# EAGLE schematic dash-hat (EAGLE 7.7.0)
Assembly variants: REVC
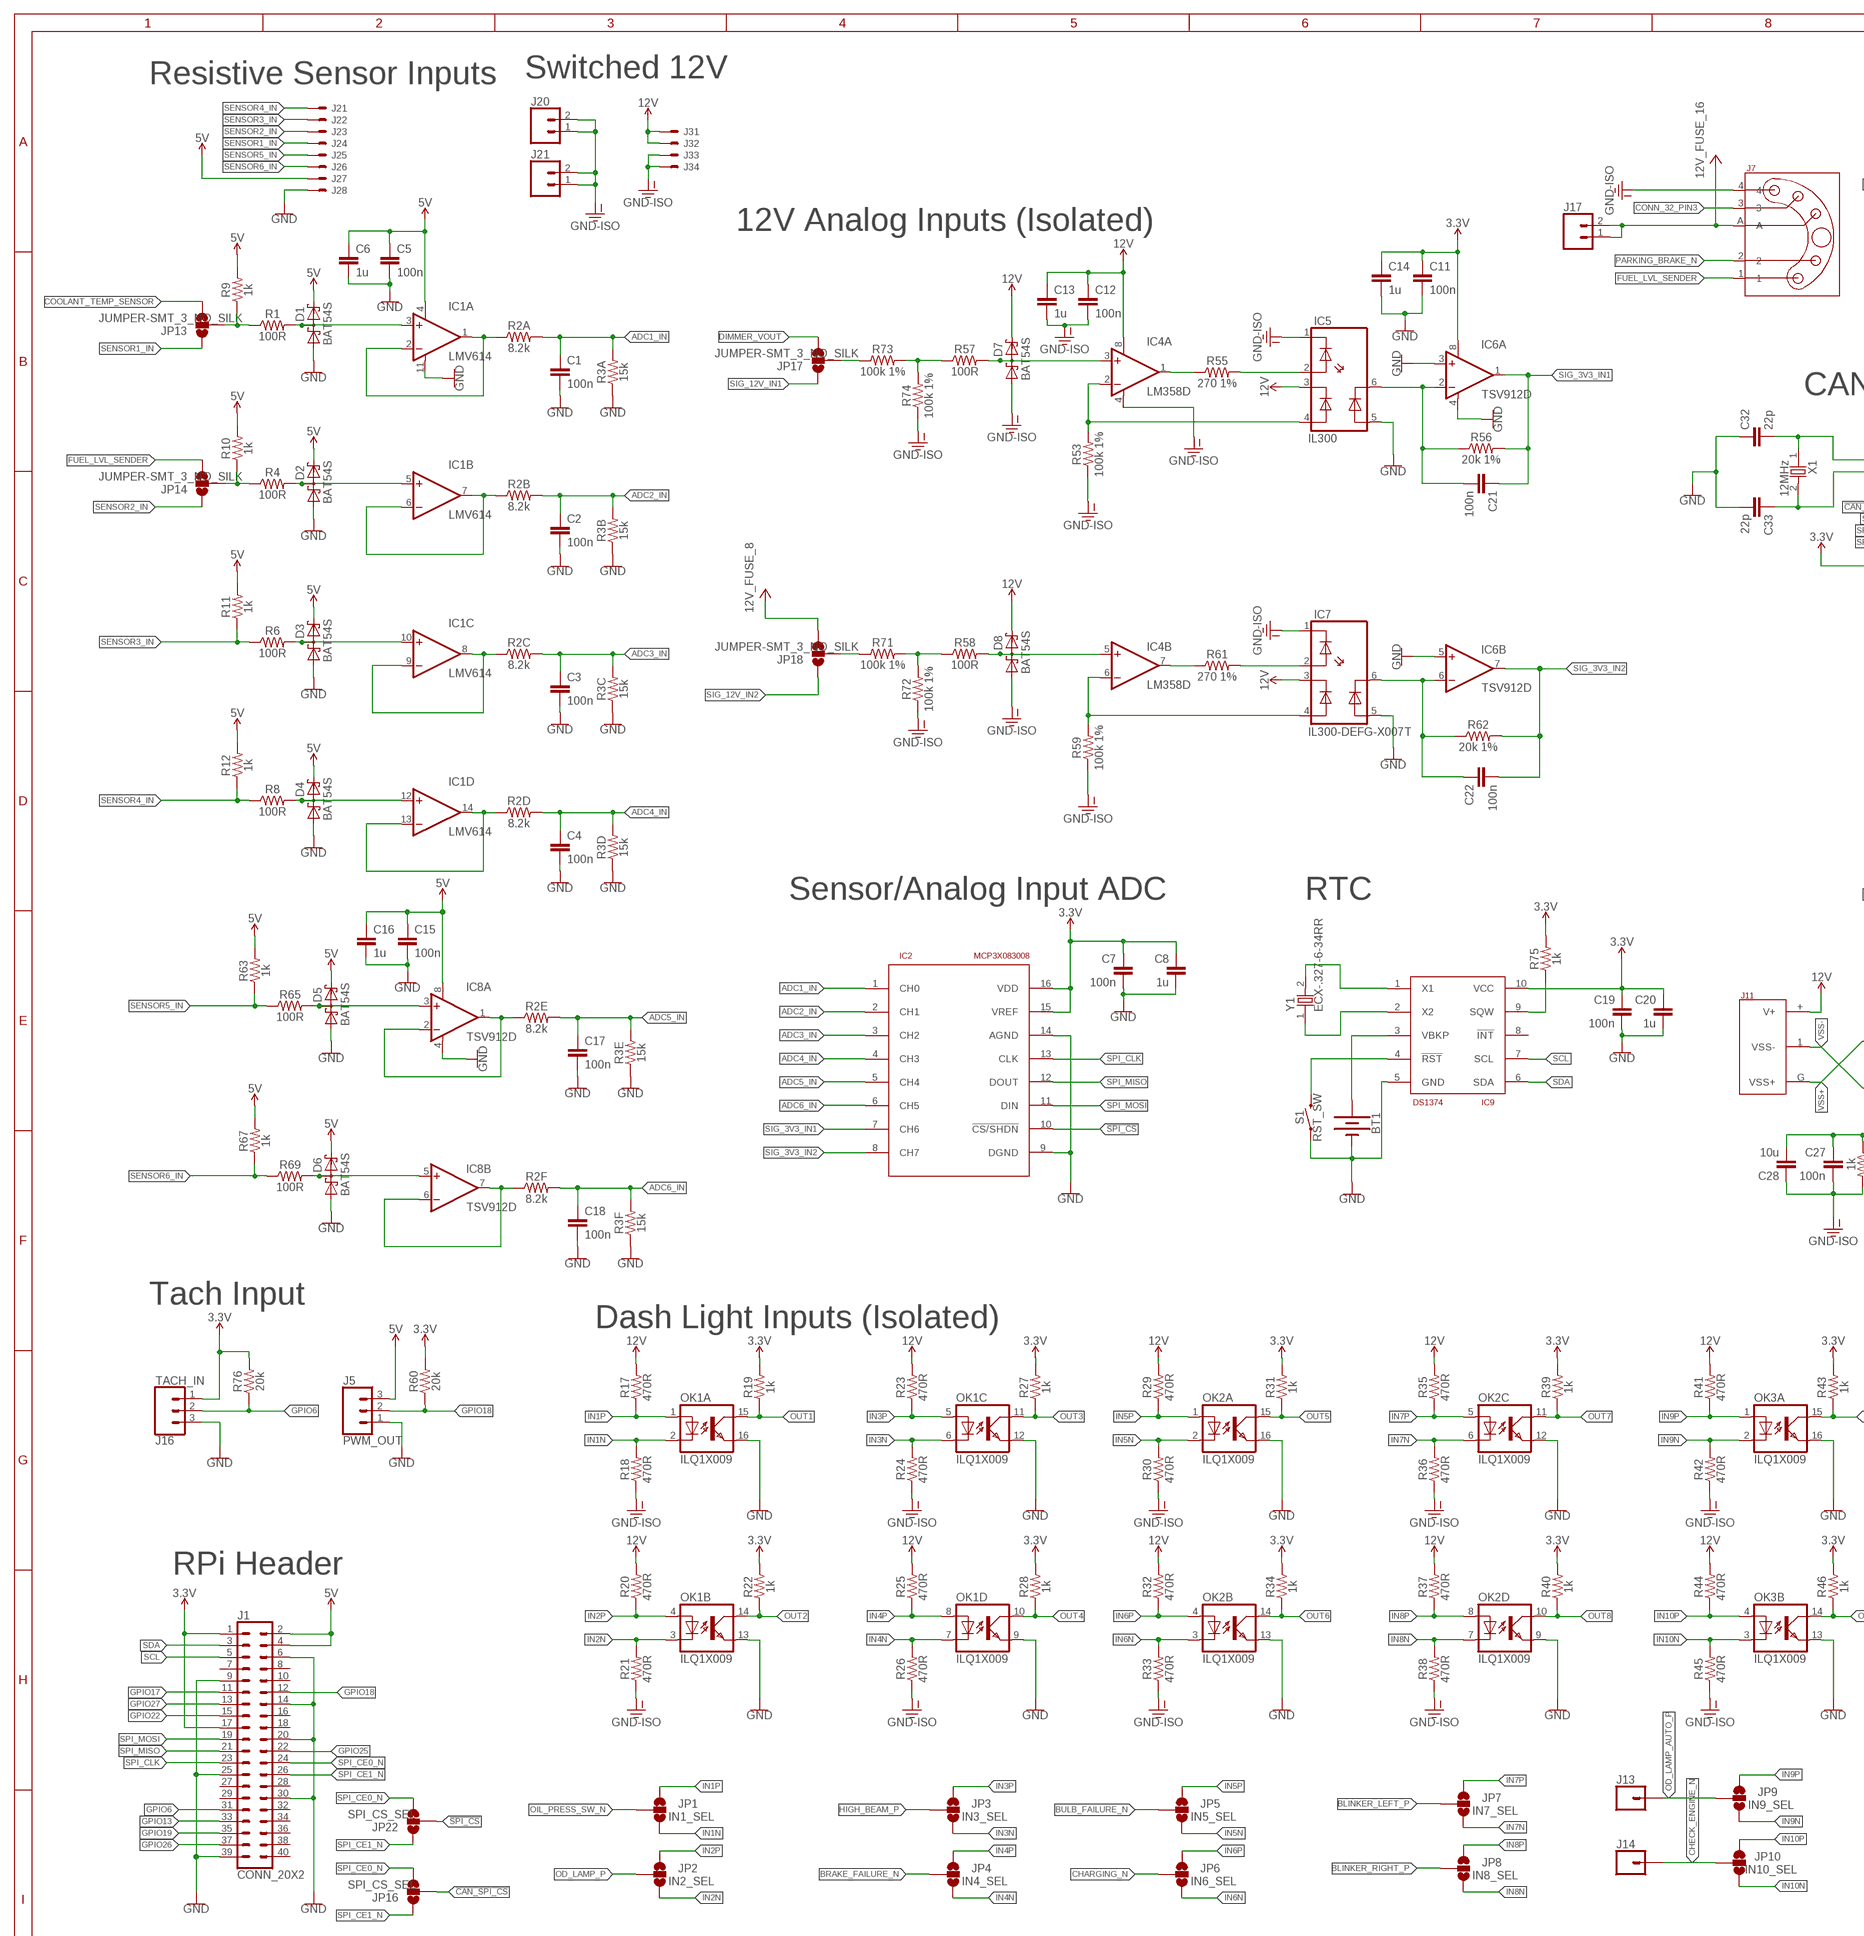
[diagram p0: schematic, sheet 1, part 1 of 2]
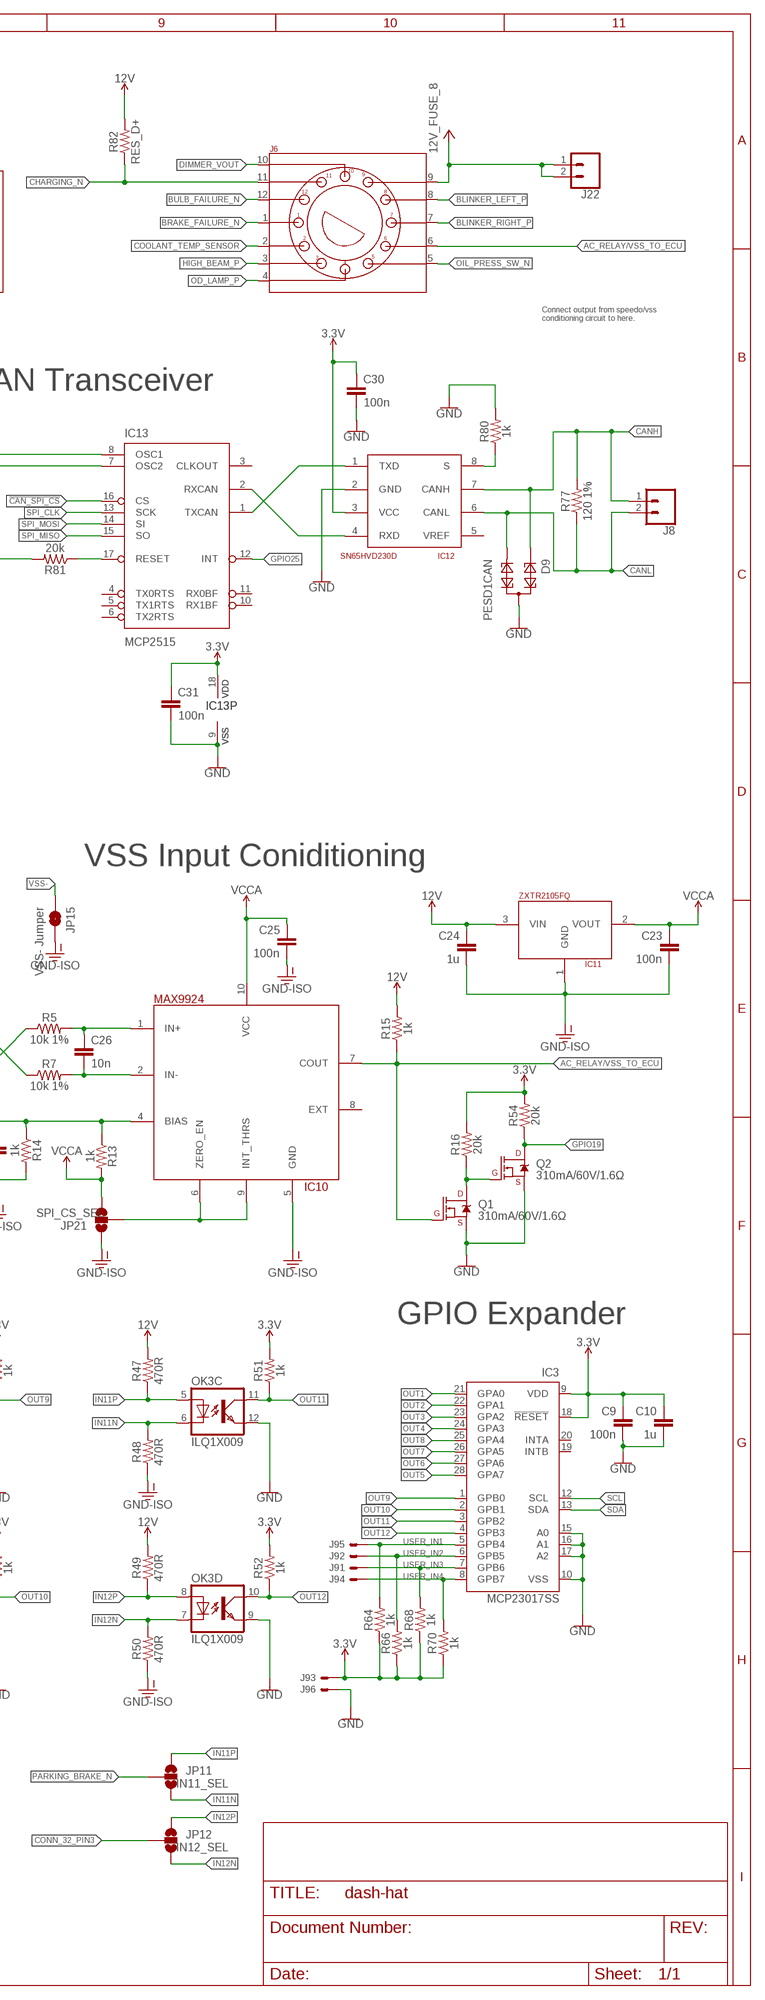
[diagram p1: schematic, sheet 1, part 2 of 2]

## Parts
BT1  BATTERY-12MM_SMD  [BATTCON_12MM]
C1  100n  CL10B104MB8NNNC  [0603]
C2  100n  CL10B104MB8NNNC  [0603]
C3  100n  CL10B104MB8NNNC  [0603]
C4  100n  CL10B104MB8NNNC  [0603]
C5  100n  CL10B104MB8NNNC  [0603]
C6  1u  CL10A105KA8NNNC  [0603]
C7  100n  CL10B104MB8NNNC  [0603]
C8  1u  CL10A105KA8NNNC  [0603]
C9  100n  CL10B104MB8NNNC  [0603]
C10  1u  CL10A105KA8NNNC  [0603]
C11  100n  CL10B104MB8NNNC  [0603]
C12  100n  CL10B104MB8NNNC  [0603]
C13  1u  CL10A105KA8NNNC  [0603]
C14  1u  CL10A105KA8NNNC  [0603]
C15  100n  CL10B104MB8NNNC  [0603]
C16  1u  CL10A105KA8NNNC  [0603]
C17  100n  CL10B104MB8NNNC  [0603]
C18  100n  CL10B104MB8NNNC  [0603]
C19  100n  CL10B104MB8NNNC  [0603]
C20  1u  CL10A105KA8NNNC  [0603]
C21  100n  CL10B104MB8NNNC  [0603]
C22  100n  CL10B104MB8NNNC  [0603]
C23  100n  CL10B104MB8NNNC  [0603]
C24  1u  CL10A105KA8NNNC  [0603]
C25  100n  CL10B104MB8NNNC  [0603]
C26  10n  CL10B103KB8NNNC  [0603]
C27  100n  CL10B104MB8NNNC  [0603]
C28  10u  CL10B106MQ8NRNC  [0603]
C30  100n  CL10B104MB8NNNC  [0603]
C31  100n  CL10B104MB8NNNC  [0603]
C32  22p  CL10C220JB81PNC  [0603]
C33  22p  CL10C220JB81PNC  [0603]
D1  BAT54S  [SOT23]
D2  BAT54S  [SOT23]
D3  BAT54S  [SOT23]
D4  BAT54S  [SOT23]
D5  BAT54S  [SOT23]
D6  BAT54S  [SOT23]
D7  BAT54S  [SOT23]
D8  BAT54S  [SOT23]
D9  PESD1CAN  [SOT23]
IC1  LMV614  [TSSOP14]
IC2  MCP3X083008  [SO16]
IC3  MCP23017SS  [SSOP28]
IC4  LM358D  [SO08]
IC5  IL300  [DIL8-SMD]
IC6  TSV912D  [SO08]
IC7  IL300-DEFG-X007T  [DIL8-SMD]
IC8  TSV912D  [SO08]
IC9  DS1374  [UMAX10]
IC10  MAX9924  [UMAX10]
IC11  ZXTR2105FQ  [SOT23]
IC12  SN65HVD230D  [SO08]
IC13  MCP2515  MCP2515(MCP2510)SO  [SO18W]
J1  CONN_20X2  [2X20]
J2  CONN_04X2  [MOLEX-1053102108]
J3  CONN_04RIGHT-ANGLE  [MOLEX-1053141204]
J5  PWM_OUT  CONN_03JST-XHP  [1X03_JST-XHP]
J6  VOLVO_CONN_31  [VOLVO_CON_31]
J7  VOLVO_CONN_32  [VOLVO_CON_32]
J8  CONN_02JST-XHP  [1X02_JST-XHP]
J9  CONN_03X2  [MOLEX-1053101106]
J11  VOLVO_CONN_VSS  [VOLVO_CONN_VSS]
J13  CONN_01PTH_2MM  [1X01_2MM]
J14  CONN_01PTH_2MM  [1X01_2MM]
J16  TACH_IN  CONN_03JST-XHP  [1X03_JST-XHP]
J17  CONN_02PTH4  [1X02_XTRA_BIG]
J20  CONN_02PTH4  [1X02_XTRA_BIG]
J21  CONN_02PTH4  [1X02_XTRA_BIG]
J22  CONN_02PTH4  [1X02_XTRA_BIG]
JP1  IN1_SEL  JUMPER-SMT_3_NO_SILK  [SMT-JUMPER_3_NO_SILK]
JP2  IN2_SEL  JUMPER-SMT_3_NO_SILK  [SMT-JUMPER_3_NO_SILK]
JP3  IN3_SEL  JUMPER-SMT_3_NO_SILK  [SMT-JUMPER_3_NO_SILK]
JP4  IN4_SEL  JUMPER-SMT_3_NO_SILK  [SMT-JUMPER_3_NO_SILK]
JP5  IN5_SEL  JUMPER-SMT_3_NO_SILK  [SMT-JUMPER_3_NO_SILK]
JP6  IN6_SEL  JUMPER-SMT_3_NO_SILK  [SMT-JUMPER_3_NO_SILK]
JP7  IN7_SEL  JUMPER-SMT_3_NO_SILK  [SMT-JUMPER_3_NO_SILK]
JP8  IN8_SEL  JUMPER-SMT_3_NO_SILK  [SMT-JUMPER_3_NO_SILK]
JP9  IN9_SEL  JUMPER-SMT_3_NO_SILK  [SMT-JUMPER_3_NO_SILK]
JP10  IN10_SEL  JUMPER-SMT_3_NO_SILK  [SMT-JUMPER_3_NO_SILK]
JP11  IN11_SEL  JUMPER-SMT_3_NO_SILK  [SMT-JUMPER_3_NO_SILK]
JP12  IN12_SEL  JUMPER-SMT_3_NO_SILK  [SMT-JUMPER_3_NO_SILK]
JP13  JUMPER-SMT_3_NO_SILK  [SMT-JUMPER_3_NO_SILK]
JP14  JUMPER-SMT_3_NO_SILK  [SMT-JUMPER_3_NO_SILK]
JP15  VSS- Jumper  JUMPER-SMT_2_NO_SILK  [SMT-JUMPER_2_NO_SILK]
JP16  SPI_CS_SEL  JUMPER-SMT_3_NO_SILK  [SMT-JUMPER_3_NO_SILK]
JP17  JUMPER-SMT_3_NO_SILK  [SMT-JUMPER_3_NO_SILK]
JP18  JUMPER-SMT_3_NO_SILK  [SMT-JUMPER_3_NO_SILK]
JP21  SPI_CS_SEL  JUMPER-SMT_3_NO_SILK  [SMT-JUMPER_3_NO_SILK]
JP22  SPI_CS_SEL  JUMPER-SMT_3_NO_SILK  [SMT-JUMPER_3_NO_SILK]
OK1  ILQ1X009  [SMD16]
OK2  ILQ1X009  [SMD16]
OK3  ILQ1X009  [SMD16]
Q1  310mA/60V/1.6Ω  MOSFET-NCH-2N7002PW  [SOT323]
Q2  310mA/60V/1.6Ω  MOSFET-NCH-2N7002PW  [SOT323]
R1  100R  RC0603JR-07100RL  [0603]
R2  8.2k  YC248-JR-078K2L  [YC248]
R3  15k  YC248-JR-0715KL  [YC248]
R4  100R  RC0603JR-07100RL  [0603]
R5  10k 1%  RC0603FR-1010KL  [0603]
R6  100R  RC0603JR-07100RL  [0603]
R7  10k 1%  RC0603FR-1010KL  [0603]
R8  100R  RC0603JR-07100RL  [0603]
R9  1k  RC0603JR-071KL  [0603]
R10  1k  RC0603JR-071KL  [0603]
R11  1k  RC0603JR-071KL  [0603]
R12  1k  RC0603JR-071KL  [0603]
R13  1k  RC0603JR-071KL  [0603]
R14  1k  RC0603JR-071KL  [0603]
R15  1k  RC0603JR-071KL  [0603]
R16  20k  RC0603JR-0720KL  [0603]
R17  470R  RC0603JR-07470RL  [0603]
R18  470R  RC0603JR-07470RL  [0603]  (not fitted in variant REVC)
R19  1k  RC0603JR-071KL  [0603]
R20  470R  RC0603JR-07470RL  [0603]  (not fitted in variant REVC)
R21  470R  RC0603JR-07470RL  [0603]
R22  1k  RC0603JR-071KL  [0603]
R23  470R  RC0603JR-07470RL  [0603]  (not fitted in variant REVC)
R24  470R  RC0603JR-07470RL  [0603]
R25  470R  RC0603JR-07470RL  [0603]
R26  470R  RC0603JR-07470RL  [0603]  (not fitted in variant REVC)
R27  1k  RC0603JR-071KL  [0603]
R28  1k  RC0603JR-071KL  [0603]
R29  470R  RC0603JR-07470RL  [0603]
R30  470R  RC0603JR-07470RL  [0603]  (not fitted in variant REVC)
R31  1k  RC0603JR-071KL  [0603]
R32  470R  RC0603JR-07470RL  [0603]
R33  470R  RC0603JR-07470RL  [0603]  (not fitted in variant REVC)
R34  1k  RC0603JR-071KL  [0603]
R35  470R  RC0603JR-07470RL  [0603]  (not fitted in variant REVC)
R36  470R  RC0603JR-07470RL  [0603]
R37  470R  RC0603JR-07470RL  [0603]  (not fitted in variant REVC)
R38  470R  RC0603JR-07470RL  [0603]
R39  1k  RC0603JR-071KL  [0603]
R40  1k  RC0603JR-071KL  [0603]
R41  470R  RC0603JR-07470RL  [0603]  (not fitted in variant REVC)
R42  470R  RC0603JR-07470RL  [0603]  (not fitted in variant REVC)
R43  1k  RC0603JR-071KL  [0603]
R44  470R  RC0603JR-07470RL  [0603]
R45  470R  RC0603JR-07470RL  [0603]  (not fitted in variant REVC)
R46  1k  RC0603JR-071KL  [0603]
R47  470R  RC0603JR-07470RL  [0603]
R48  470R  RC0603JR-07470RL  [0603]  (not fitted in variant REVC)
R49  470R  RC0603JR-07470RL  [0603]  (not fitted in variant REVC)
R50  470R  RC0603JR-07470RL  [0603]  (not fitted in variant REVC)
R51  1k  RC0603JR-071KL  [0603]
R52  1k  RC0603JR-071KL  [0603]
R53  100k 1%  RC0603FR-10100KL  [0603]
R54  20k  RC0603JR-0720KL  [0603]
R55  270 1%  RC0603FR-07270RL  [0603]
R56  20k 1%  RC0603FR-0720KL  [0603]
R57  100R  RC0603JR-07100RL  [0603]
R58  100R  RC0603JR-07100RL  [0603]
R59  100k 1%  RC0603FR-10100KL  [0603]
R60  20k  RC0603JR-0720KL  [0603]
R61  270 1%  RC0603FR-07270RL  [0603]
R62  20k 1%  RC0603FR-0720KL  [0603]
R63  1k  RC0603JR-071KL  [0603]
R64  1k  RC0603JR-071KL  [0603]
R65  100R  RC0603JR-07100RL  [0603]
R66  1k  RC0603JR-071KL  [0603]
R67  1k  RC0603JR-071KL  [0603]
R68  1k  RC0603JR-071KL  [0603]
R69  100R  RC0603JR-07100RL  [0603]
R70  1k  RC0603JR-071KL  [0603]
R71  100k 1%  RC0603FR-10100KL  [0603]
R72  100k 1%  RC0603FR-10100KL  [0603]
R73  100k 1%  RC0603FR-10100KL  [0603]
R74  100k 1%  RC0603FR-10100KL  [0603]
R75  1k  RC0603JR-071KL  [0603]
R76  20k  RC0603JR-0720KL  [0603]
R77  120 1%  RC0603FR-07120RL  [0603]
R80  1k  RC0603JR-071KL  [0603]
R81  20k  RC0603JR-0720KL  [0603]
R82  RES_D+  [0617/17]
S1  RST_SW  MOMENTARY-SWITCH-SPST-SMD-6.0X3.5MM  [TACTILE_SWITCH_SMD_6.0X3.5MM]
X1  12MHz  ECS-120-20-3X-TR  [ECS]
Y1  ECX-.327-6-34RR  [ECX-34RR]

## Nets
3.3V: C7.1 C8.1 C9.1 C10.1 C11.1 C14.1 C19.1 C20.1 C30.1 C31.1 IC2.15(VREF) IC2.16(VDD) IC3.9(VDD) IC3.18(!RESET) IC6.8(A:V+) IC9.10(VCC) IC12.3(VCC) IC13.18(VDD) J1.1 J1.17 J9.3 J16.1 R16.2 R19.2 R22.2 R27.2 R28.2 R31.2 R34.2 R39.2 R40.2 R43.2 R46.2 R51.2 R52.2 R54.2 R60.2 R64.1 R66.1 R68.1 R70.1 R75.2 R76.2 R81.2
5V: C5.1 C6.1 C15.1 C16.1 D1.2(C2) D2.2(C2) D3.2(C2) D4.2(C2) D5.2(C2) D6.2(C2) IC1.4(A:V+) IC8.8(A:V+) J1.2 J1.4 J2.7 J5.3 R9.2 R10.2 R11.2 R12.2 R63.2 R67.2
12V: C12.1 C13.1 C24.1 D7.2(C2) D8.2(C2) IC4.8(A:V+) IC5.3(C3) IC7.3(C3) IC11.3(VIN) J3.1 J3.2 J11.+(V+) R15.2 R17.2 R20.2 R23.2 R25.2 R29.2 R32.2 R35.2 R37.2 R41.2 R44.2 R47.2 R49.2 R82.2
12V-FUSE_8: J6.9 J22.1 J22.2 JP18.3 ; supply symbol labelled 12V_FUSE_8
12V-FUSE_16: J7.A J17.1 J17.2 ; supply symbol labelled 12V_FUSE_16
!CAN_SPI_CS: IC13.16(CS) JP16.2
!SPI_CS: IC2.10(!CS/SHDN) JP22.2
AC_RELAY/VSS_TO_ECU: IC10.7(COUT) J6.6 Q1.1(G) R15.1
ADC1_IN: C1.1 IC2.1(CH0) R2.16 R3.16
ADC2_IN: C2.1 IC2.2(CH1) R2.15 R3.15
ADC3_IN: C3.1 IC2.3(CH2) R2.14 R3.14
ADC4_IN: C4.1 IC2.4(CH3) R2.13 R3.13
ADC5_IN: C17.1 IC2.5(CH4) R2.12 R3.12
ADC6_IN: C18.1 IC2.6(CH5) R2.11 R3.11
BLINKER_LEFT_P: J6.8 JP7.2
BLINKER_RIGHT_P: J6.7 JP8.2
BRAKE_FAILURE_N: J6.1 JP4.2
BULB_FAILURE_N: J6.12 JP5.2
CANH: D9.1 IC12.7(CANH) J8.1 R77.2
CANL: D9.2 IC12.6(CANL) J8.2 R77.1
CHARGING_N: J6.11 JP6.2 R82.1
CHECK_ENGINE_N: J14.1 JP10.2
CONN_32_PIN3: J7.3 JP12.2
COOLANT_TEMP_SENSOR: J6.2 JP13.3
DIMMER_VOUT: J6.10 JP17.3
FUEL_LVL_SENDER: J7.1 JP14.3
GND: BT1.GND(-) C1.2 C2.2 C3.2 C4.2 C5.2 C6.2 C7.2 C8.2 C9.2 C10.2 C11.2 C14.2 C15.2 C16.2 C17.2 C18.2 C19.2 C20.2 C30.2 C31.2 C32.1 C33.2 D1.1(A1) D2.1(A1) D3.1(A1) D4.1(A1) D5.1(A1) D6.1(A1) D9.3 IC1.11(A:V-) IC2.9(DGND) IC2.14(AGND) IC3.10(VSS) IC3.15(A0) IC3.16(A1) IC3.17(A2) IC5.5(A5) IC6.3(A:+IN) IC6.4(A:V-) IC6.5(B:+IN) IC7.5(A5) IC8.4(A:V-) IC9.5(GND) IC12.2(GND) IC13.9(VSS) J1.6 J1.9 J1.14 J1.20 J1.25 J1.30 J1.39 J2.8 J5.1 J9.6 J16.3 OK1.9(D:EMIT) OK1.12(C:EMIT) OK1.13(B:EMIT) OK1.16(A:EMIT) OK2.9(D:EMIT) OK2.12(C:EMIT) OK2.13(B:EMIT) OK2.16(A:EMIT) OK3.9(D:EMIT) OK3.12(C:EMIT) OK3.13(B:EMIT) OK3.16(A:EMIT) Q1.2(S) Q2.2(S) R3.1 R3.2 R3.3 R3.4 R3.5 R3.6 R80.2 S1.1
GND-ISO: C12.2 C13.2 C23.2 C24.2 C25.2 C27.2 C28.1 D7.1(A1) D8.1(A1) IC4.4(A:V-) IC5.1(C1) IC7.1(C1) IC10.5(GND) IC11.1(GND) J3.3 J3.4 J7.4 J20.1 J20.2 J21.1 J21.2 JP15.2 JP21.1 R14.2 R18.1 R21.1 R24.1 R26.1 R30.1 R33.1 R36.1 R38.1 R42.1 R45.1 R48.1 R50.1 R53.1 R59.1 R72.1 R74.1
GPIO6: J1.31 J16.2 R76.1
GPIO13: J1.33
GPIO17: J1.11
GPIO18: J1.12 J5.2 R60.1
GPIO19: J1.35 Q2.3(D) R54.1
GPIO22: J1.15
GPIO25: IC13.12(INT) J1.22
GPIO26: J1.37
GPIO27: J1.13
HIGH_BEAM_P: J6.3 JP3.2
IN1_12V_SIGNAL: R57.1 R73.2 R74.2
IN1N: JP1.3 OK1.2(A:C) R18.2
IN1P: JP1.1 OK1.1(A:A) R17.1
IN2N: JP2.3 OK1.3(B:C) R21.2
IN2P: JP2.1 OK1.4(B:A) R20.1
IN3N: JP3.3 OK1.6(C:C) R24.2
IN3P: JP3.1 OK1.5(C:A) R23.1
IN4N: JP4.3 OK1.7(D:C) R26.2
IN4P: JP4.1 OK1.8(D:A) R25.1
IN5N: JP5.3 OK2.2(A:C) R30.2
IN5P: JP5.1 OK2.1(A:A) R29.1
IN6N: JP6.3 OK2.3(B:C) R33.2
IN6P: JP6.1 OK2.4(B:A) R32.1
IN7N: JP7.3 OK2.6(C:C) R36.2
IN7P: JP7.1 OK2.5(C:A) R35.1
IN8N: JP8.3 OK2.7(D:C) R38.2
IN8P: JP8.1 OK2.8(D:A) R37.1
IN9N: JP9.3 OK3.2(A:C) R42.2
IN9P: JP9.1 OK3.1(A:A) R41.1
IN10N: JP10.3 OK3.3(B:C) R45.2
IN10P: JP10.1 OK3.4(B:A) R44.1
IN11N: JP11.3 OK3.6(C:C) R48.2
IN11P: JP11.1 OK3.5(C:A) R47.1
IN12N: JP12.3 OK3.7(D:C) R50.2
IN12P: JP12.1 OK3.8(D:A) R49.1
N$1: IC1.1(A:OUT) IC1.2(A:-IN) R2.1
N$2: D7.3(C1A2) IC4.3(A:+IN) R57.2
N$3: D1.3(C1A2) IC1.3(A:+IN) R1.2
N$4: IC4.2(A:-IN) IC5.4(A4) R53.2
N$5: IC1.6(B:-IN) IC1.7(B:OUT) R2.2
N$6: D8.3(C1A2) IC4.5(B:+IN) R58.2
N$7: D2.3(C1A2) IC1.5(B:+IN) R4.2
N$8: IC4.6(B:-IN) IC7.4(A4) R59.2
N$9: IC1.8(C:OUT) IC1.9(C:-IN) R2.3
N$10: C21.2 IC5.6(C6) IC6.2(A:-IN) R56.1
N$11: D3.3(C1A2) IC1.10(C:+IN) R6.2
N$12: IC12.8(S) R80.1
N$13: IC1.13(D:-IN) IC1.14(D:OUT) R2.4
N$14: Q1.3(D) Q2.1(G) R16.1
N$15: D4.3(C1A2) IC1.12(D:+IN) R8.2
N$16: JP13.2 R1.1 R9.1
N$17: R58.1 R71.2 R72.2
N$18: C32.2 IC13.8(OSC1) X1.1
N$19: JP18.2 R71.1
N$20: IC4.1(A:OUT) R55.1
N$21: IC4.7(B:OUT) R61.1
N$22: JP14.2 R4.1 R10.1
N$23: JP17.2 R73.1
N$24: IC9.1(X1) Y1.2
N$25: IC5.2(A2) R55.2
N$26: IC7.2(A2) R61.2
N$27: C22.1 IC6.6(B:-IN) IC7.6(C6) R62.1
N$28: IC8.1(A:OUT) IC8.2(A:-IN) R2.5
N$29: D5.3(C1A2) IC8.3(A:+IN) R65.2
N$31: C33.1 IC13.7(OSC2) X1.2
N$32: IC9.2(X2) Y1.1
N$35: IC8.6(B:-IN) IC8.7(B:OUT) R2.6
N$36: D6.3(C1A2) IC8.5(B:+IN) R69.2
N$37: IC12.4(RXD) IC13.2(RXCAN)
N$38: BT1.PWR@1(+) IC9.3(VBKP)
N$39: IC9.9(SQW) R75.1
N$40: IC12.1(TXD) IC13.1(TXCAN)
N$41: IC9.4(!RST) S1.2
N$43: IC13.17(RESET) R81.1
N$46: C26.1 IC10.1(IN+) R5.2
N$47: C26.2 IC10.2(IN-) R7.2
N$50: C27.1 C28.2 IC10.4(BIAS) R13.1 R14.1
N$52: IC10.6(ZERO_EN) IC10.9(INT_THRS) JP21.2
OD_LAMP_AUTO_P: J13.1 JP9.2
OD_LAMP_P: J6.4 JP2.2
OIL_PRESS_SW_N: J6.5 JP1.2
OUT1: IC3.21(GPA0) OK1.15(A:COL) R19.1
OUT2: IC3.22(GPA1) OK1.14(B:COL) R22.1
OUT3: IC3.23(GPA2) OK1.11(C:COL) R27.1
OUT4: IC3.24(GPA3) OK1.10(D:COL) R28.1
OUT5: IC3.28(GPA7) OK2.15(A:COL) R31.1
OUT6: IC3.27(GPA6) OK2.14(B:COL) R34.1
OUT7: IC3.26(GPA5) OK2.11(C:COL) R39.1
OUT8: IC3.25(GPA4) OK2.10(D:COL) R40.1
OUT9: IC3.1(GPB0) OK3.15(A:COL) R43.1
OUT10: IC3.2(GPB1) OK3.14(B:COL) R46.1
OUT11: IC3.3(GPB2) OK3.11(C:COL) R51.1
OUT12: IC3.4(GPB3) OK3.10(D:COL) R52.1
PARKING_BRAKE_N: J7.2 JP11.2
SCL: IC3.12(SCL) IC9.7(SCL) J1.5
SDA: IC3.13(SDA) IC9.6(SDA) J1.3
SENSOR1_IN: J2.4 JP13.1
SENSOR2_IN: J2.3 JP14.1
SENSOR3_IN: J2.2 R6.1 R11.1
SENSOR4_IN: J2.1 R8.1 R12.1
SENSOR5_IN: J2.5 R63.1 R65.1
SENSOR6_IN: J2.6 R67.1 R69.1
SIG_3V3_IN1: C21.1 IC2.7(CH6) IC6.1(A:OUT) R56.2
SIG_3V3_IN2: C22.2 IC2.8(CH7) IC6.7(B:OUT) R62.2
SIG_12V_IN1: JP17.1
SIG_12V_IN2: JP18.1
SPI_CE0_N: J1.24 JP16.3 JP22.3
SPI_CE1_N: J1.26 JP16.1 JP22.1
SPI_CLK: IC2.13(CLK) IC13.13(SCK) J1.23
SPI_MISO: IC2.12(DOUT) IC13.15(SO) J1.21
SPI_MOSI: IC2.11(DIN) IC13.14(SI) J1.19
USER_IN1: IC3.5(GPB4) J9.5 R64.2
USER_IN2: IC3.6(GPB5) J9.2 R66.2
USER_IN3: IC3.7(GPB6) J9.1 R68.2
USER_IN4: IC3.8(GPB7) J9.4 R70.2
VCCA: C23.1 C25.1 IC10.10(VCC) IC11.2(VOUT) JP21.3 R13.2
VSS+: J11.G(VSS+) R5.1
VSS-: J11.1(VSS-) JP15.1 R7.1
Unconnected: IC3.19(INTB) IC3.20(INTA) IC9.8(!INT) IC10.8(EXT) IC12.5(VREF) IC13.3(CLKOUT) IC13.4(TX0RTS) IC13.5(TX1RTS) IC13.6(TX2RTS) IC13.10(RX1BF) IC13.11(RX0BF) J1.7 J1.8 J1.10 J1.16 J1.18 J1.27 J1.28 J1.29 J1.32 J1.34 J1.36 J1.38 J1.40 R2.7 R2.8 R2.9 R2.10 R3.7 R3.8 R3.9 R3.10

## Notes on the sheet
- Resistive Sensor Inputs | Switched 12V
- 12V Analog Inputs (Isolated)
- Connect output from speedo/vss 
  conditioning circuit to here.
- CAN Transceiver
- VSS Input Coniditioning
- Sensor/Analog Input ADC | RTC
- Tach Input
- Dash Light Inputs (Isolated)
- GPIO Expander
- RPi Header

## Library data of the parts
BT1 = SparkFun-Batteries:BATTERY: Battery - Single Cell A variety of battery chemistries, sizes, and footprints. Device List: 20MM_PTH - Coin Cell Battery Holder - 20mm (PTH) <https://www.sparkfun.com/products/783> 20MM_PTH_KIT- Coin Cell battery Holder - 20 mm (PTH) <http://www.sparkfun.com/products/783>kit version with special mask 6.8MM_PTH - Coin Cell Battery Holder - 6.8MM(SMD) <https://www.digikey.com/product-detail/en/seiko-instruments/MS621FE-FL11E/728-1057-ND/1889208?WT.srch=1&gclid=CNOQ5a6LzdQCFZS2wAodXCkE0g> 12MM_SMD - Coin Cell Battery Holder - 12mm (SMD) <https://www.sparkfun.com/products/10592> 12MM_PTH - Coin Cell Battery Holder - 12mm (PTH) <https://www.sparkfun.com/products/7948> 20MM_SMD - 20mm Coin Cell Battery Holder (SMD) (2 legs) Used on the Big Time Watch Kit <https://www.sparkfun.com/products/11734> 20MM_SMD_4LEGS - Coin Cell Battery Holder - 20mm (SMD) <https://www.sparkfun.com/products/11892> 20MM_SMD_4LEGS_OVERPASTE - Coin Cell Battery Holder - 20mm (SMD) <https://www.sparkfun.com/products/11892> (Over-paste on the legs) 24.5MM_PTH - Coin Cell Battery Holder - 24.5mm (PTH) <https://www.sparkfun.com/products/8863> 9V - 9V Battery Holder - PC Mount Used on the SparkFun SparkPunk Sound Kit <https://www.sparkfun.com/products/11177> and SparkFun SparkPunk Sequencer Kit <https://www.sparkfun.com/products/12707> 18650 - Battery Holder - 18650 (PTH) <https://www.sparkfun.com/products/13113> AA - Battery Holder - 1xAA (PTH) <https://www.sparkfun.com/products/7949> AAA - Battery Holder - 1xAAA (PTH) <https://www.sparkfun.com/products/12718> AA_KIT - Battery Holder - 1xAA (PTH) <https://www.sparkfun.com/products/7949> Special kit package - pads only have exposed copper on one side of the board. AAA_KIT - Battery Holder - 1xAAA (PTH) <https://www.sparkfun.com/products/12718> Special kit package - pads only have exposed copper on one side of the board.; PROD_ID: BATT-08044; SF_SKU: PRT-10592
C1-C5 C7 C9 C11 C12 C15 C17-C19 C21-C23 C25-C27 C30-C33 = digital_dash:CL; VOLTAGE: 50V
C6 C8 C10 C13 C14 C16 C20 C24 = digital_dash:CL; VOLTAGE: 25V
C28 = digital_dash:CL; VOLTAGE: 6.3V
D1-D8 = diode:BAT54S: Schottky Diodes Pin connection corrected 2011-05-04 Source: Fairchild .. BAT54.pdf
D9 = diode:PESD1CAN: CAN bus ESD protection diode Source: http://www.nxp.com/documents/data_sheet/PESD1CAN.pdf
IC1 = digital_dash:LMV614
IC2 = digital_dash:MCP3X08
IC3 = microchip:MCP23017: http://ww1.microchip.com/downloads/en/DeviceDoc/21952a.pdf Source: http://ww1.microchip.com/downloads/en/DeviceDoc/21952a.pdf; MF: MICROCHIP; MPN: MCP23017-E/SS; OC_FARNELL: 1467674; OC_NEWARK: 31K2960
IC4 = digital_dash:LM358: OP AMP also LM158; LM258; LM2904 Source: http://cache.national.com/ds/LM/LM158.pdf
IC5 IC7 = digital_dash:IL300
IC6 IC8 = digital_dash:TSV912: OP AMP also TSV912A Source: https://www.ti.com/lit/ds/symlink/tsv912.pdf
IC9 = digital_dash:DS1374
IC10 = digital_dash:MAX9924
IC11 = digital_dash:ZXTR2105
IC12 = digital_dash:SN65HVD23
IC13 = SparkFun-IC-Comms:MCP2515(MCP2510): CAN controller with SPI interface The MCP2515 controller supercedes the MCP2510 while addressing all errata associated with it. The two devices are pin compatible, either can be used with this device. 18-pin package SOIC Simple SPI interface to any MCU. One-shot mode ensures message transmission is attempted only once Databyte filtering Start-of-Frame (SOF) output Low-power CMOS Technology Datasheet <http://www.sparkfun.com/datasheets/DevTools/Arduino/MCP2515.pdf> SparkFun Products CAN-BUS Shield <https://www.sparkfun.com/products/13262> (DEV-13262); PROD_ID: IC-09906
J1 = SparkFun-Connectors:CONN_20X2: Multi connection point. Often used as Generic Header-pin footprint for 0.1 inch spaced/style header connections On any of the 0.1 inch spaced packages, you can populate with these: Break Away Headers - Straight <https://www.sparkfun.com/products/116> (PRT-00116) Break Away Male Headers - Right Angle <https://www.sparkfun.com/products/553> (PRT-00553) Female Headers <https://www.sparkfun.com/products/115> (PRT-00115) Break Away Headers - Machine Pin <https://www.sparkfun.com/products/117> (PRT-00117) Break Away Female Headers - Swiss Machine Pin <https://www.sparkfun.com/products/743> (PRT-00743)
J2 = digital_dash:CONN_04X2
J3 = digital_dash:CONN_04
J5 J16 = digital_dash:CONN_03: Multi connection point. Often used as Generic Header-pin footprint for 0.1 inch spaced/style header connections On any of the 0.1 inch spaced packages, you can populate with these: Break Away Headers - Straight <https://www.sparkfun.com/products/116> (PRT-00116) Break Away Male Headers - Right Angle <https://www.sparkfun.com/products/553> (PRT-00553) Female Headers <https://www.sparkfun.com/products/115> (PRT-00115) Break Away Headers - Machine Pin <https://www.sparkfun.com/products/117> (PRT-00117) Break Away Female Headers - Swiss Machine Pin <https://www.sparkfun.com/products/743> (PRT-00743) Stackable Header - 3 Pin (Female, 0.1") <https://www.sparkfun.com/products/13875> (PRT-13875) For SCREWTERMINALS and SPRING TERMINALS visit here: Screw Terimnals on SparkFun.com <https://www.sparkfun.com/search/results?term=Screw+Terminals> (5mm/3.5mm/2.54mm spacing) This device is also useful as a general connection point to wire up your design to another part of your project. Our various solder wires solder well into these plated through hole pads. Hook-Up Wire - Assortment (Stranded, 22 AWG) <https://www.sparkfun.com/products/11375> (PRT-11375) Hook-Up Wire - Assortment (Solid Core, 22 AWG) <https://www.sparkfun.com/products/11367> (PRT-11367) View the entire wire category on our website here <https://www.sparkfun.com/categories/141> Special notes: Molex polarized connector foot print use with SKU : PRT-08232 with associated crimp pins and housings.
J6 = digital_dash:VOLVO_CONN_31
J7 = digital_dash:VOLVO_CONN_32
J8 = digital_dash:CONN_02: Multi connection point. Often used as Generic Header-pin footprint for 0.1 inch spaced/style header connections On any of the 0.1 inch spaced packages, you can populate with these: Break Away Headers - Straight <https://www.sparkfun.com/products/116> (PRT-00116) Break Away Male Headers - Right Angle <https://www.sparkfun.com/products/553> (PRT-00553) Female Headers <https://www.sparkfun.com/products/115> (PRT-00115) Break Away Headers - Machine Pin <https://www.sparkfun.com/products/117> (PRT-00117) Break Away Female Headers - Swiss Machine Pin <https://www.sparkfun.com/products/743> (PRT-00743) For SCREWTERMINALS and SPRING TERMINALS visit here: Screw Terimnals on SparkFun.com <https://www.sparkfun.com/search/results?term=Screw+Terminals> (5mm/3.5mm/2.54mm spacing) This device is also useful as a general connection point to wire up your design to another part of your project. Our various solder wires solder well into these plated through hole pads. Hook-Up Wire - Assortment (Stranded, 22 AWG) <https://www.sparkfun.com/products/11375> (PRT-11375) Hook-Up Wire - Assortment (Solid Core, 22 AWG) <https://www.sparkfun.com/products/11367> (PRT-11367) View the entire wire category on our website here <https://www.sparkfun.com/categories/141> Special notes: Molex polarized connector foot print use with: PRT-08233 with associated crimp pins and housings. 2.54_SCREWTERM for use with PRT-10571. 3.5mm Screw Terminal footprints for PRT-08084 5mm Screw Terminal footprints for use with PRT-08432
J9 = digital_dash:CONN_03X2
J11 = digital_dash:VOLVO_CONN_VSS
J13 J14 = SparkFun-Connectors:CONN_01: Single connection point. Often used as Generic Header-pin footprint for 0.1 inch spaced/style header connections On any of the 0.1 inch spaced packages, you can populate with these: Break Away Headers - Straight <https://www.sparkfun.com/products/116> (PRT-00116) Break Away Male Headers - Right Angle <https://www.sparkfun.com/products/553> (PRT-00553) Female Headers <https://www.sparkfun.com/products/115> (PRT-00115) Break Away Headers - Machine Pin <https://www.sparkfun.com/products/117> (PRT-00117) Break Away Female Headers - Swiss Machine Pin <https://www.sparkfun.com/products/743> (PRT-00743) This device is also useful as a general connection point to wire up your design to another part of your project. Our various solder wires solder well into these plated through hole pads. Hook-Up Wire - Assortment (Stranded, 22 AWG) <https://www.sparkfun.com/products/11375> (PRT-11375) Hook-Up Wire - Assortment (Solid Core, 22 AWG) <https://www.sparkfun.com/products/11367> (PRT-11367) View the entire wire category on our website here <https://www.sparkfun.com/categories/141> Special notes: SMTSO-256-ET is a "flush mount" nut for a 4-40 screw. We mostly use this on specialty testbeds; it is a nice way to connect hardware to your PCB at an adjustable hieght. Also note, the SNAP packages are for using a snappable style connector. We sell a baggie of snaps and they are also used on two LilyPad designs: Snap Assortment - 30 pack (male and female) <https://www.sparkfun.com/products/11347> (DEV-11347) LilyPad Arduino SimpleSnap <https://www.sparkfun.com/products/10941> (DEV-10941) LilyPad SimpleSnap Protoboard <https://www.sparkfun.com/products/10940> (DEV-10940)
J17 J20-J22 = SparkFun-Connectors:CONN_02: Multi connection point. Often used as Generic Header-pin footprint for 0.1 inch spaced/style header connections On any of the 0.1 inch spaced packages, you can populate with these: Break Away Headers - Straight <https://www.sparkfun.com/products/116> (PRT-00116) Break Away Male Headers - Right Angle <https://www.sparkfun.com/products/553> (PRT-00553) Female Headers <https://www.sparkfun.com/products/115> (PRT-00115) Break Away Headers - Machine Pin <https://www.sparkfun.com/products/117> (PRT-00117) Break Away Female Headers - Swiss Machine Pin <https://www.sparkfun.com/products/743> (PRT-00743) For SCREWTERMINALS and SPRING TERMINALS visit here: Screw Terimnals on SparkFun.com <https://www.sparkfun.com/search/results?term=Screw+Terminals> (5mm/3.5mm/2.54mm spacing) This device is also useful as a general connection point to wire up your design to another part of your project. Our various solder wires solder well into these plated through hole pads. Hook-Up Wire - Assortment (Stranded, 22 AWG) <https://www.sparkfun.com/products/11375> (PRT-11375) Hook-Up Wire - Assortment (Solid Core, 22 AWG) <https://www.sparkfun.com/products/11367> (PRT-11367) View the entire wire category on our website here <https://www.sparkfun.com/categories/141> Special notes: Molex polarized connector foot print use with: PRT-08233 with associated crimp pins and housings. 2.54_SCREWTERM for use with PRT-10571. 3.5mm Screw Terminal footprints for PRT-08084 5mm Screw Terminal footprints for use with PRT-08432
JP1-JP14 JP16-JP18 JP21 JP22 = SparkFun-Jumpers:JUMPER-SMT_3_NO: Normally open jumper This jumper has three pads in close proximity to each other. Apply solder to close the connection(s).
JP15 = SparkFun-Jumpers:JUMPER-SMT_2_NO: Normally open jumper This jumper has two pads in close proximity to each other. Apply solder to close the connection. Round pads are easier to solder for beginners, but are a lot larger. SparkFun Product that uses the round pads: SparkFun EL Sequencer <https://www.sparkfun.com/products/12781>
OK1-OK3 = digital_dash:ILQ1: SIEMENS OPTO COUPLER
Q1 Q2 = SparkFun-DiscreteSemi:MOSFET-NCH: N-channel MOSFETs Voltage controlled devices that allow control of high current outputs. SparkFun Products: SparkFun OpenScale <https://www.sparkfun.com/products/13261> SparkFun Digital Sandbox <https://www.sparkfun.com/products/12651> SparkFun Monster Moto Shield <https://www.sparkfun.com/products/10182> SparkFun MOSFET Power Controller <https://www.sparkfun.com/products/11214>; PROD_ID: TRANS-11151
R1 R4 R6 R8-R52 R54 R57 R58 R60 R63-R70 R75 R76 R80 R81 = digital_dash:RC0603JR
R2 R3 = digital_dash:YC248; TOLERANCE: 5%
R5 R7 R53 R55 R56 R59 R61 R62 R71-R74 R77 = digital_dash:RC0603FR
R82 = digital_dash:RES_D+
S1 = SparkFun-Switches:MOMENTARY-SWITCH-SPST: Momentary Switch (Pushbutton) - SPST Normally-open (NO) SPST momentary switches (buttons, pushbuttons). Variants PTH-12MM - 12mm square, through-hole Momentary Pushbutton Switch - 12mm Square <https://www.sparkfun.com/products/9190> (COM-09190) PTH-6.0MM, PTH-6.0MM-KIT - 6.0mm square, through-hole Mini Pushbutton Switch <https://www.sparkfun.com/products/97> (COM-00097) KIT package intended for soldering kit's - only one side of pads' copper is exposed. PTH-RIGHT-ANGLE-KIT - Right-angle, through-hole Right Angle Tactile Button <https://www.sparkfun.com/products/10791> - Used on SparkFun BigTime Watch Kit <https://www.sparkfun.com/products/11734> SMD-12MM - 12mm square, surface-mount Tactile Button - SMD (12mm) <https://www.sparkfun.com/products/12993> (COM-12993) Used on SparkFun PicoBoard <https://www.sparkfun.com/products/11888> SMD-4.5MM - 4.5mm Square Trackball Switch Used on SparkFun Blackberry Trackballer Breakout <https://www.sparkfun.com/products/13169> SMD-4.6MMX2.8MM - 4.60mm x 2.80mm, surface mount Used on SparkFun Pro Micro - RP2040 <https://www.sparkfun.com/products/17717> SMD-5.2MM, SMD-5.2-REDUNDANT - 5.2mm square, surface-mount Mini Pushbutton Switch - SMD <https://www.sparkfun.com/products/8720> (COM-08720) Used on Arduino Pro Mini <https://www.sparkfun.com/products/11114> REDUNDANT package connects both switch circuits together SMD-6.0X3.5MM - 6.0 x 3.5mm, surface mount Momentary Reset Switch SMD <https://www.sparkfun.com/products/8229> (COM-08229) SMD-6.2MM-TALL - 6.2mm square, surface mount Tactile Button - SMD (6mm) <https://www.sparkfun.com/products/12992> Used on SparkFun Digital Sandbox <https://www.sparkfun.com/products/12651> SMD-RIGHT-ANGLE - Right-angle, surface mount Used on SparkFun Block for Intel® Edison - Arduino <https://www.sparkfun.com/products/13036>; PROD_ID: SWCH-14278; SF_SKU: COM-08229
X1 = digital_dash:ECS
Y1 = digital_dash:ECX